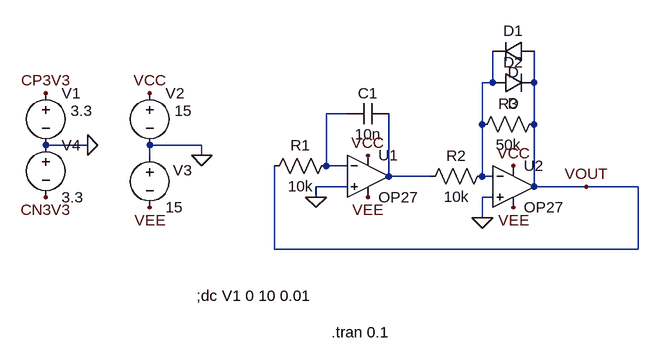
[diagram p0: schematic Draft26.asc]
Draft26.asc, the LTspice schematic file:
Version 4
SHEET 1 904 680
WIRE 384 -64 384 -112
WIRE 384 -64 368 -64
WIRE 448 -64 448 -112
WIRE 160 -16 128 -16
WIRE 368 0 368 -64
WIRE 448 0 448 -64
WIRE -240 32 -304 32
WIRE -64 32 -144 32
WIRE -144 48 -144 32
WIRE -64 48 -64 32
WIRE 128 64 128 -16
WIRE 160 64 128 64
WIRE 224 80 224 -16
WIRE 288 80 224 80
WIRE 368 80 368 0
WIRE 384 80 368 80
WIRE 160 96 112 96
WIRE 448 96 448 0
WIRE 528 96 448 96
WIRE 608 96 528 96
WIRE 112 112 112 96
WIRE 384 112 368 112
WIRE 368 144 368 112
WIRE 48 192 48 64
WIRE 608 192 608 96
WIRE 608 192 48 192
FLAG 112 112 0
FLAG -64 48 0
FLAG 528 96 VOUT
FLAG -144 -48 VCC
FLAG 416 64 VCC
FLAG -144 128 VEE
FLAG 416 128 VEE
FLAG 368 144 0
FLAG -240 32 0
FLAG -304 -48 CP3V3
FLAG -304 112 CN3V3
FLAG 192 48 VCC
FLAG 192 112 VEE
SYMBOL voltage -144 -64 R0
WINDOW 123 0 0 Left 0
WINDOW 39 0 0 Left 0
WINDOW 3 38 43 Left 2
SYMATTR Value 15
SYMATTR InstName V2
SYMBOL voltage -144 32 R0
WINDOW 123 0 0 Left 0
WINDOW 39 0 0 Left 0
WINDOW 0 36 39 Left 2
SYMATTR InstName V3
SYMATTR Value 15
SYMBOL diode 448 -128 R90
WINDOW 0 0 32 VBottom 2
WINDOW 3 32 32 VTop 2
SYMATTR InstName D1
SYMBOL diode 384 -48 R270
WINDOW 0 32 32 VTop 2
WINDOW 3 0 32 VBottom 2
SYMATTR InstName D2
SYMBOL res 384 64 R90
WINDOW 0 0 56 VBottom 2
WINDOW 3 32 56 VTop 2
SYMATTR InstName R2
SYMATTR Value 10k
SYMBOL res 464 -16 R90
WINDOW 0 0 56 VBottom 2
WINDOW 3 32 56 VTop 2
SYMATTR InstName R3
SYMATTR Value 50k
SYMBOL OpAmps\\OP27 416 32 R0
SYMATTR InstName U2
SYMBOL voltage -304 -64 R0
WINDOW 123 0 0 Left 0
WINDOW 39 0 0 Left 0
WINDOW 3 38 43 Left 2
SYMATTR Value 3.3
SYMATTR InstName V1
SYMBOL voltage -304 16 R0
WINDOW 123 0 0 Left 0
WINDOW 39 0 0 Left 0
SYMATTR InstName V4
SYMATTR Value 3.3
SYMBOL OpAmps\\OP27 192 16 R0
SYMATTR InstName U1
SYMBOL cap 224 -32 R90
WINDOW 0 0 32 VBottom 2
WINDOW 3 32 32 VTop 2
SYMATTR InstName C1
SYMATTR Value 10n
SYMBOL res 144 48 R90
WINDOW 0 0 56 VBottom 2
WINDOW 3 32 56 VTop 2
SYMATTR InstName R1
SYMATTR Value 10k
TEXT -72 264 Left 2 !;dc V1 0 10 0.01
TEXT 136 320 Left 2 !.tran 0.1

The netlist it stands for:
* Draft26.asc
V2 VCC 0 15
V3 0 VEE 15
D1 VOUT N001 D
D2 N001 VOUT D
R2 N001 N003 10k
R3 VOUT N001 50k
XU2 0 N001 VCC VEE VOUT OP27  ; pins In+ In- V+ V- OUT
V1 CP3V3 0 3.3
V4 0 CN3V3 3.3
XU1 0 N002 VCC VEE N003 OP27  ; pins In+ In- V+ V- OUT
C1 N003 N002 10n
R1 N002 VOUT 10k
.model D D
.lib standard.dio
;dc V1 0 10 0.01
.tran 0.1
.lib ADI.lib
.backanno
.end